# Altium schematic sheet jeu_du_moulin_boura_uP_SCH.SchDoc
size A3; Organization: Ecole des Métiers de Fribourg; Address1: Ch. du Musée 2; Address2: 1700 Fribourg; Address3: Switzerland; DocumentNumber: 1; SheetNumber: 1; SheetTotal: 3; BraceOpen: [; BraceClose: ]; Point: .
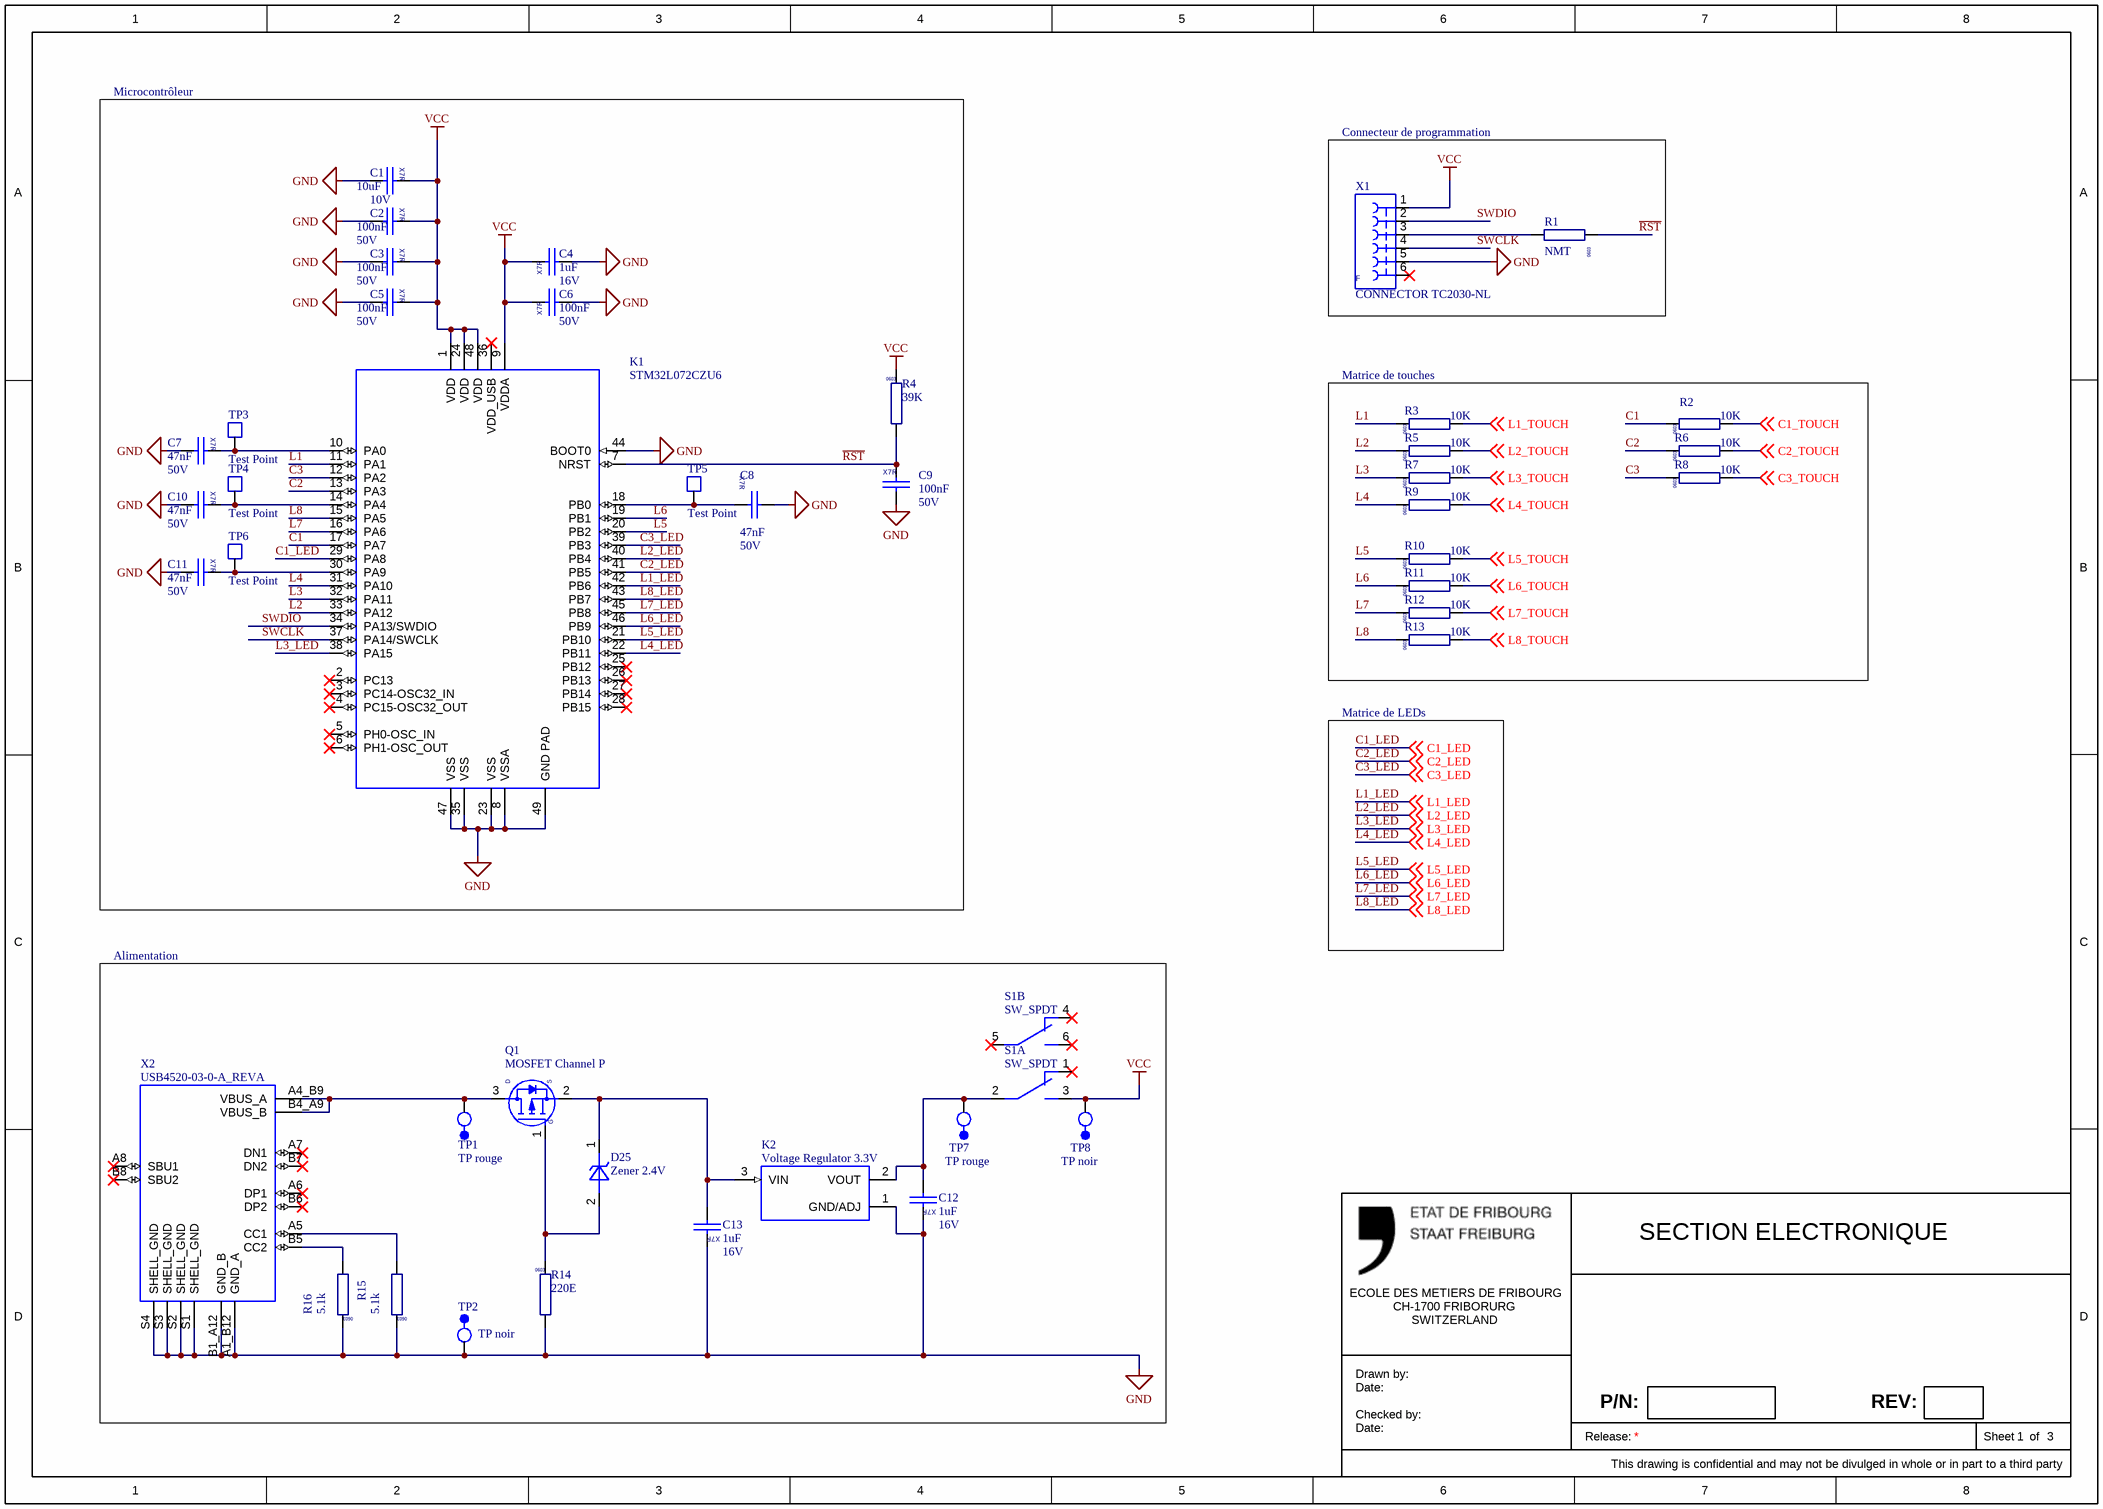
[diagram p0: jeu_du_moulin_boura_uP_SCH.SchDoc]

## Parts
C1  10uF  Volt: 10V  [CSMD0603]
C2  100nF  Volt: 50V  [CSMD0603]
C3  100nF  Volt: 50V  [CSMD0603]
C4  1uF  Volt: 16V  [CSMD0603]
C5  100nF  Volt: 50V  [CSMD0603]
C6  100nF  Volt: 50V  [CSMD0603]
C7  47nF  Volt: 50V  [CSMD0603]
C8  47nF  Volt: 50V  [CSMD0603]
C9  100nF  Volt: 50V  [CSMD0603]
C10  47nF  Volt: 50V  [CSMD0603]
C11  47nF  Volt: 50V  [CSMD0603]
C12  1uF  Volt: 16V  [CSMD0603]
C13  1uF  Volt: 16V  [CSMD0603]
D25  Zener 2.4V  [SOD-123]
K1  STM32L072CZU6  [UFQFPN48]
K2  Voltage Regulator 3.3V  [SOT95P240X88-3N]
Q1  MOSFET Channel P  [SOT95P240X88-3N]
R1  NMT  [RSMD0603]
R2  10K  [RSMD0603]
R3  10K  [RSMD0603]
R4  39K  [RSMD0603]
R5  10K  [RSMD0603]
R6  10K  [RSMD0603]
R7  10K  [RSMD0603]
R8  10K  [RSMD0603]
R9  10K  [RSMD0603]
R10  10K  [RSMD0603]
R11  10K  [RSMD0603]
R12  10K  [RSMD0603]
R13  10K  [RSMD0603]
R14  220E  [RSMD0603]
R15  5.1k  [RSMD0603]
R16  5.1k  [RSMD0603]
S1  SW_SPDT  [Switch Slide DPDT]  (parts A,B of 2)
TP1  TP rouge  [TP10_22]
TP2  TP noir  [TP10_22]
TP3  Test Point  [TP]
TP4  Test Point  [TP]
TP5  Test Point  [TP]
TP6  Test Point  [TP]
TP7  TP rouge  [TP10_22]
TP8  TP noir  [TP10_22]
X1  CONNECTOR TC2030-NL  [T-Connect 2030]
X2  USB4520-03-0-A_REVA  [GCT_USB4520-03-0-A_REVA]

## Blocks framed on the sheet
Microcontrôleur: C1-C11 K1 R4 TP3-TP6
Connecteur de programmation: R1 X1
Matrice de touches: R2 R3 R5-R13
Alimentation: C12 C13 D25 K2 Q1 R14-R16 S1 TP1 TP2 TP7 TP8 X2

## Nets
GND: C1.2 C2.2 C3.2 C4.2 C5.2 C6.2 C7.2 C8.2 C9.2 C10.2 C11.2 C12.1 C13.1 K1.8(VSSA) K1.23(VSS) K1.35(VSS) K1.44(BOOT0) K1.47(VSS) K1.49(GND_PAD) K2.1(GND/ADJ) R14.2 R15.1 R16.1 TP2.1(a) X1.5(GND) X2.A1_B12(GND_A) X2.B1_A12(GND_B) X2.S1(SHELL_GND) X2.S2(SHELL_GND) X2.S3(SHELL_GND) X2.S4(SHELL_GND)
VCC: C1.1 C2.1 C3.1 C4.1 C5.1 C6.1 K1.1(VDD) K1.9(VDDA) K1.24(VDD) K1.48(VDD) R4.1 S1.3 TP8.1(a) X1.1(VDD_VIOREF)
C1: K1.17(PA7) R2.1
C1_LED: K1.29(PA8) ; off-sheet C1_LED
C1_TOUCH: R2.2 ; off-sheet C1_TOUCH
C2: K1.13(PA3) R6.1
C2_LED: K1.41(PB5) ; off-sheet C2_LED
C2_TOUCH: R6.2 ; off-sheet C2_TOUCH
C3: K1.12(PA2) R8.1
C3_LED: K1.39(PB3) ; off-sheet C3_LED
C3_TOUCH: R8.2 ; off-sheet C3_TOUCH
L1: K1.11(PA1) R3.1
L1_LED: K1.42(PB6) ; off-sheet L1_LED
L1_TOUCH: R3.2 ; off-sheet L1_TOUCH
L2: K1.33(PA12) R5.1
L2_LED: K1.40(PB4) ; off-sheet L2_LED
L2_TOUCH: R5.2 ; off-sheet L2_TOUCH
L3: K1.32(PA11) R7.1
L3_LED: K1.38(PA15) ; off-sheet L3_LED
L3_TOUCH: R7.2 ; off-sheet L3_TOUCH
L4: K1.31(PA10) R9.1
L4_LED: K1.22(PB11) ; off-sheet L4_LED
L4_TOUCH: R9.2 ; off-sheet L4_TOUCH
L5: K1.20(PB2) R10.1
L5_LED: K1.21(PB10) ; off-sheet L5_LED
L5_TOUCH: R10.2 ; off-sheet L5_TOUCH
L6: K1.19(PB1) R11.1
L6_LED: K1.46(PB9) ; off-sheet L6_LED
L6_TOUCH: R11.2 ; off-sheet L6_TOUCH
L7: K1.16(PA6) R12.1
L7_LED: K1.45(PB8) ; off-sheet L7_LED
L7_TOUCH: R12.2 ; off-sheet L7_TOUCH
L8: K1.15(PA5) R13.1
L8_LED: K1.43(PB7) ; off-sheet L8_LED
L8_TOUCH: R13.2 ; off-sheet L8_TOUCH
~{RST}: C9.1 K1.7(NRST) R1.1 R4.2
SWCLK: K1.37(PA14/SWCLK) X1.4(SWCLK)
SWDIO: K1.34(PA13/SWDIO) X1.2(SWDIO)
NetC7_1: C7.1 K1.10(PA0) TP3.1(a)
NetC8_1: C8.1 K1.18(PB0) TP5.1(a)
NetC10_1: C10.1 K1.14(PA4) TP4.1(a)
NetC11_1: C11.1 K1.30(PA9) TP6.1(a)
NetC12_2: C12.2 K2.2(VOUT) S1.2 TP7.1(a)
NetC13_2: C13.2 D25.1(CATHODE) K2.3(VIN) Q1.2(Drain)
NetD25_2: D25.2(ANODE) Q1.1(Gate) R14.1
NetQ1_3: Q1.3(Source) TP1.1(a) X2.A4_B9(VBUS_A) X2.B4_A9(VBUS_B)
NetR1_2: R1.2 X1.3(NMVLR/RESET)
NetR15_2: R15.2 X2.A5(CC1)
NetR16_2: R16.2 X2.B5(CC2)

Not connected (* = marked no-connect by the designer): K1 2(PC13)* 3(PC14-OSC32_IN)* 4(PC15-OSC32_OUT)* 5(PH0-OSC_IN)* 6(PH1-OSC_OUT)* 25(PB12)* 26(PB13)* 27(PB14)* 28(PB15)* 36(VDD_USB)*; S1 1* 4* 5* 6*; X1 6(SWO)*; X2 A6(DP1)* A7(DN1)* A8(SBU1)* B6(DP2)* B7(DN2)* B8(SBU2)*

## Notes on the sheet
- Matrice de LEDs
- SECTION ELECTRONIQUE
- CH-1700 FRIBORURG
- SWITZERLAND
- ECOLE DES METIERS DE FRIBOURG
- Drawn by:
- Date:
- Checked by:
- Release:
- P/N:
- REV:
- Sheet
- of
- This drawing is confidential and may not be divulged in whole or in part to a third party
- (in symbol 5.1k) 0603
- (in symbol CER-HV-12) X7R
- (in symbol CER-HV-13) X7R
- (in symbol CONNECTOR TC2030-NL) F
- (in symbol CX7R-20) X7R
- (in symbol CX7R-24) X7R
- (in symbol MOSFET Channel P) D; S; G
- (in symbol RSMD0603-06) 0603
- (in symbol RSMD0603-26) 0603
- (in symbol RSMD0603-33) 0603
- (in symbol RSMD0603-81) 0603

## Library data of the parts
C1 = CER-HV-13: C X5R 10uF 20% 10V 0603; Manufacturer Part Number 1: C0603C106M8PACTU; Type: CX7R; Tol: 0.2; EMF_PN: CER-HV-13; Value: 10uF
C2 C3 C5 C6 C9 = CX7R-24: C X7R 0.1uF 10% 50V 0603; Manufacturer Part Number 1: C0603C104K5RAC; Type: CX7R; Tol: 0.05; EMF_PN: CX7R-24; Value: 100nF
C4 C12 C13 = CER-HV-12: C X7R 1uF 10% 16V 0603; Manufacturer Part Number 1: C0603C105K4RAC; Type: CX7R; Tol: 0.1; EMF_PN: CER-HV-12; Value: 1uF
C7 C8 C10 C11 = CX7R-20: C X7R 47nF 10% 50V 0603; Manufacturer Part Number 1: C0603C473K5RAC; Type: CX7R; Tol: 0.1; EMF_PN: CX7R-20; Value: 47nF
D25 = Zener 2.4V: Diodes - Zener 2.4 V 500 mW ±5% Montage en surface SOD-123
K1 = STM32L072CZU6: IC MCU 32BIT 192KB FLASH UFQFPN48s
K2 = Voltage Regulator 3.3V: 3.3-Volt Low Drop Out Voltage Regulatator
Q1 = MOSFET Channel P: MOSFET Pch -80V -10A TO-252, Power MOSFET
R1 = RSMD0603-81: R SMD NOT MOUNTED  1% 60mW  CHIP 0603; Tol: 0.01; Stab(ppm): 100; EMF_PN: RSMD0603-81; Value: NMT; Type: RSMD-0603; Power: 60mW
R2 R3 R5-R13 = RSMD0603-26: R SMD 10K  1%  60mW  CHIP 0603; Tol: 0.01; Stab(ppm): 100; EMF_PN: RSMD0603-26; Value: 10K; Type: RSMD-0603; Power: 60mW
R4 = RSMD0603-33: R SMD 39K  1%  60mW  CHIP 0603; Tol: 0.01; Stab(ppm): 100; EMF_PN: RSMD0603-33; Value: 39K; Type: RSMD-0603; Power: 60mW
R14 = RSMD0603-06: R SMD 220E  1% 60mW  CHIP 0603; Tol: 0.01; Stab(ppm): 100; EMF_PN: RSMD0603-06; Value: 220E; Type: RSMD-0603; Power: 60mW
R15 R16 = 5.1k: 5.1 kOhms ±1% 0,1W, 1/10W Pavé résistif 0603 (1608 métrique) AutomobileAEC-Q200 Couche épaisse
S1 = SW_SPDT: Switch slide SPDT 300mA 6V
TP1 = TP-04: Point de test CI isolé rouge; Manufacturer 1: Keystone Electronics; Manufacturer Part Number 1: 5000; EMF_PN: TP-04; Value: TP rouge; Type: TP
TP2 = TP-03: Point de test CI isolé noir; Manufacturer 1: Keystone Electronics; Manufacturer Part Number 1: 5001; EMF_PN: TP-03; Value: TP noir; Type: TP
TP3-TP6 = Test Point: Point de Test SMD
TP7 = TP-04: Point de test CI isolé rouge; Manufacturer Part Number 1: 5000; Manufacturer 1: Keystone Electronics; EMF_PN: TP-04; Value: TP rouge; Type: TP
TP8 = TP-03: Point de test CI isolé noir; Manufacturer Part Number 1: 5001; Manufacturer 1: Keystone Electronics; EMF_PN: TP-03; Value: TP noir; Type: TP
X1 = CONNECTOR TC2030-NL: Connecteur pour TC2030-NL
X2 = USB4520-03-0-A_REVA: USB-C (USB TYPE-C) USB 2.0 Receptacle Connector 24 (16+8 Dummy) Position Board Edge, Cutout; Surface Mount; Through Hole, Right Angle